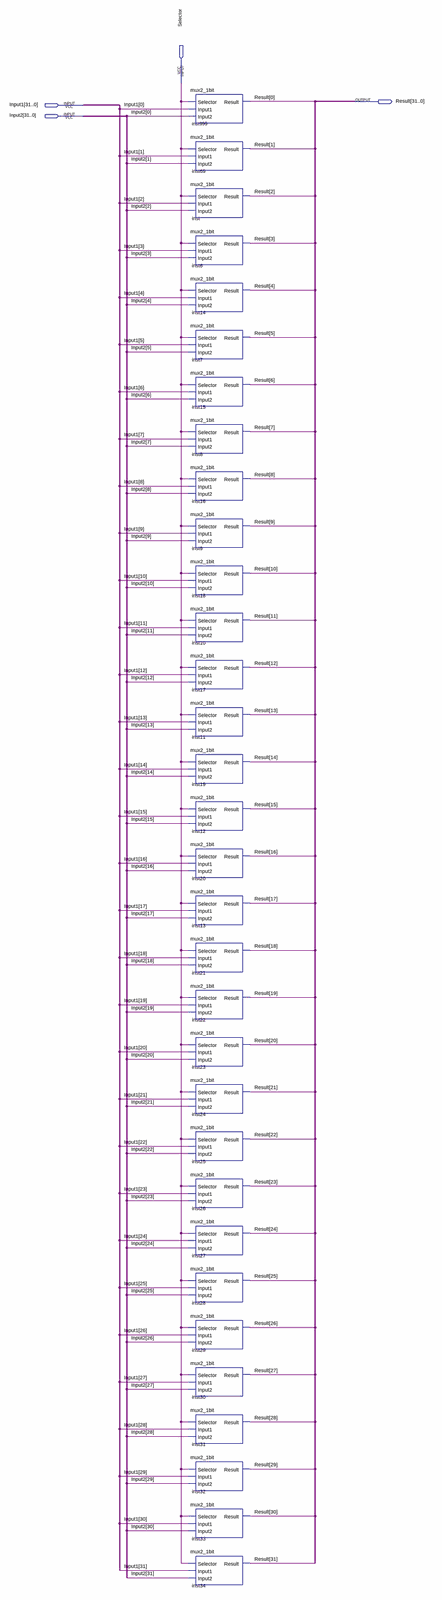
[diagram p0: schematic sheet, whole]
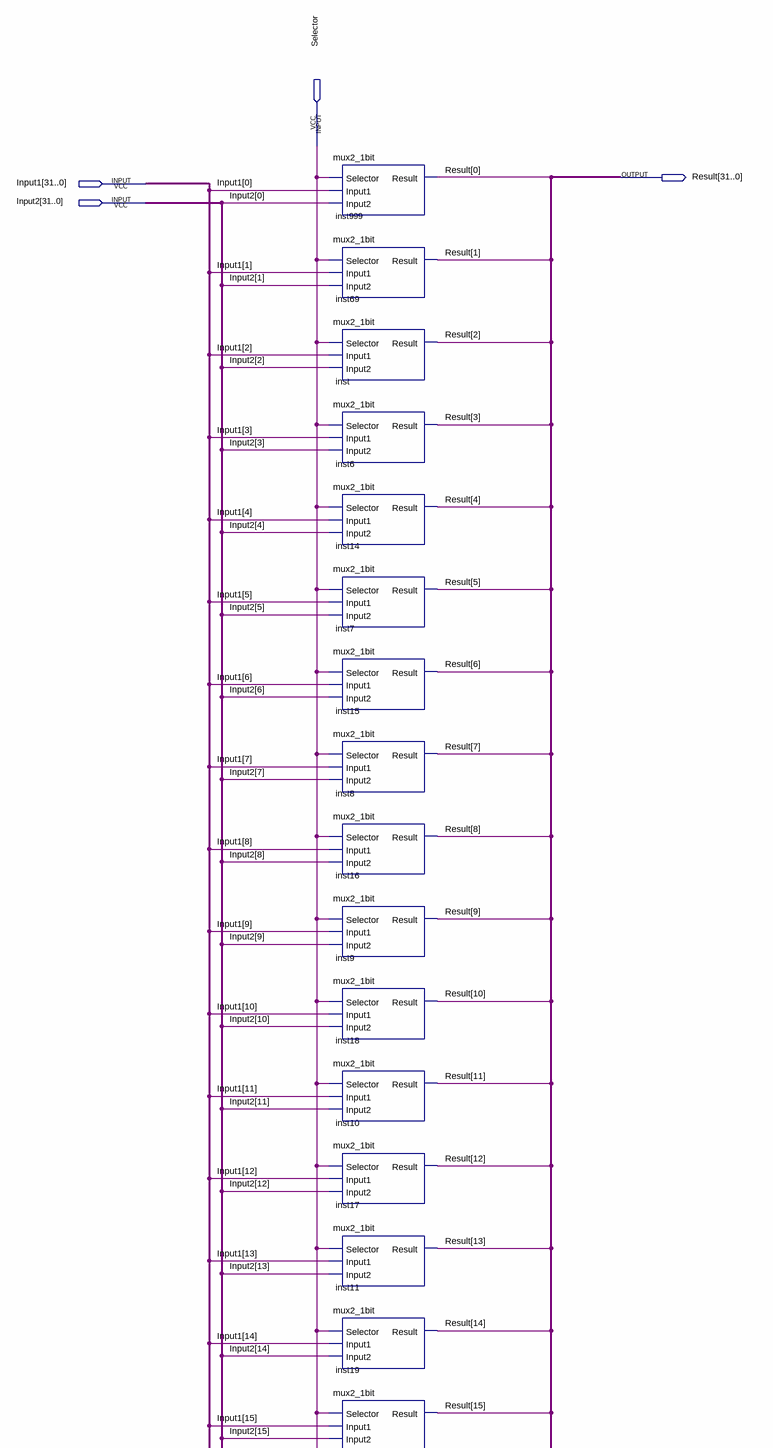
[diagram p1: schematic sheet, upper part]
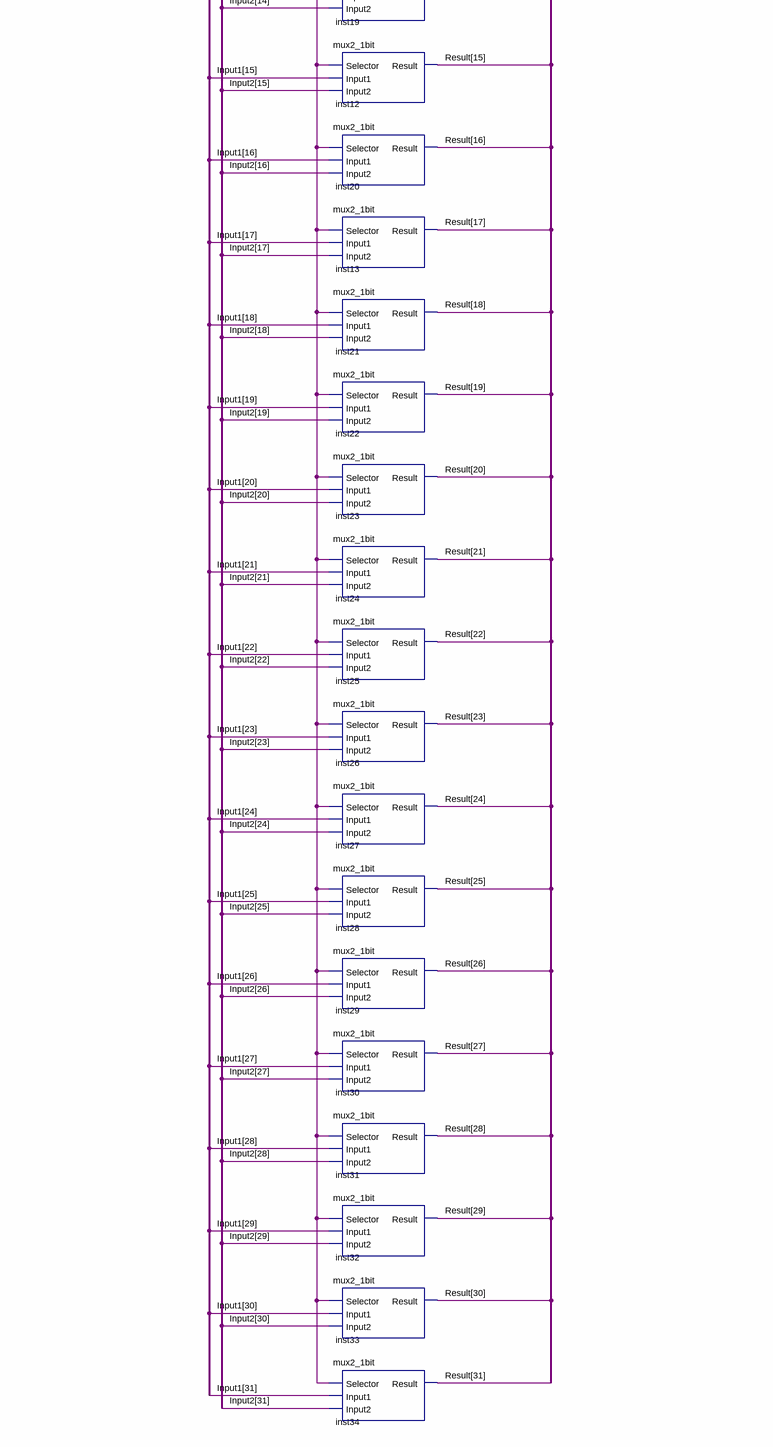
[diagram p2: schematic sheet, lower part]
// Quartus schematic mux2_32bit.bdf as structural Verilog: 32 symbols, 4 pins
module mux2_32bit (
  input  Selector,
  input  [31:0] Input1,
  input  [31:0] Input2,
  output [31:0] Result
);

  mux2_1bit inst999 (.Selector(Selector), .Input1(Input1[0]), .Input2(Input2[0]), .Result(Result[0]));
  mux2_1bit inst69 (.Selector(Selector), .Input1(Input1[1]), .Input2(Input2[1]), .Result(Result[1]));
  mux2_1bit inst (.Selector(Selector), .Input1(Input1[2]), .Input2(Input2[2]), .Result(Result[2]));
  mux2_1bit inst6 (.Selector(Selector), .Input1(Input1[3]), .Input2(Input2[3]), .Result(Result[3]));
  mux2_1bit inst14 (.Selector(Selector), .Input1(Input1[4]), .Input2(Input2[4]), .Result(Result[4]));
  mux2_1bit inst7 (.Selector(Selector), .Input1(Input1[5]), .Input2(Input2[5]), .Result(Result[5]));
  mux2_1bit inst15 (.Selector(Selector), .Input1(Input1[6]), .Input2(Input2[6]), .Result(Result[6]));
  mux2_1bit inst8 (.Selector(Selector), .Input1(Input1[7]), .Input2(Input2[7]), .Result(Result[7]));
  mux2_1bit inst16 (.Selector(Selector), .Input1(Input1[8]), .Input2(Input2[8]), .Result(Result[8]));
  mux2_1bit inst9 (.Selector(Selector), .Input1(Input1[9]), .Input2(Input2[9]), .Result(Result[9]));
  mux2_1bit inst18 (.Selector(Selector), .Input1(Input1[10]), .Input2(Input2[10]), .Result(Result[10]));
  mux2_1bit inst10 (.Selector(Selector), .Input1(Input1[11]), .Input2(Input2[11]), .Result(Result[11]));
  mux2_1bit inst17 (.Selector(Selector), .Input1(Input1[12]), .Input2(Input2[12]), .Result(Result[12]));
  mux2_1bit inst11 (.Selector(Selector), .Input1(Input1[13]), .Input2(Input2[13]), .Result(Result[13]));
  mux2_1bit inst19 (.Selector(Selector), .Input1(Input1[14]), .Input2(Input2[14]), .Result(Result[14]));
  mux2_1bit inst12 (.Selector(Selector), .Input1(Input1[15]), .Input2(Input2[15]), .Result(Result[15]));
  mux2_1bit inst20 (.Selector(Selector), .Input1(Input1[16]), .Input2(Input2[16]), .Result(Result[16]));
  mux2_1bit inst13 (.Selector(Selector), .Input1(Input1[17]), .Input2(Input2[17]), .Result(Result[17]));
  mux2_1bit inst21 (.Selector(Selector), .Input1(Input1[18]), .Input2(Input2[18]), .Result(Result[18]));
  mux2_1bit inst22 (.Selector(Selector), .Input1(Input1[19]), .Input2(Input2[19]), .Result(Result[19]));
  mux2_1bit inst23 (.Selector(Selector), .Input1(Input1[20]), .Input2(Input2[20]), .Result(Result[20]));
  mux2_1bit inst24 (.Selector(Selector), .Input1(Input1[21]), .Input2(Input2[21]), .Result(Result[21]));
  mux2_1bit inst25 (.Selector(Selector), .Input1(Input1[22]), .Input2(Input2[22]), .Result(Result[22]));
  mux2_1bit inst26 (.Selector(Selector), .Input1(Input1[23]), .Input2(Input2[23]), .Result(Result[23]));
  mux2_1bit inst27 (.Selector(Selector), .Input1(Input1[24]), .Input2(Input2[24]), .Result(Result[24]));
  mux2_1bit inst28 (.Selector(Selector), .Input1(Input1[25]), .Input2(Input2[25]), .Result(Result[25]));
  mux2_1bit inst29 (.Selector(Selector), .Input1(Input1[26]), .Input2(Input2[26]), .Result(Result[26]));
  mux2_1bit inst30 (.Selector(Selector), .Input1(Input1[27]), .Input2(Input2[27]), .Result(Result[27]));
  mux2_1bit inst31 (.Selector(Selector), .Input1(Input1[28]), .Input2(Input2[28]), .Result(Result[28]));
  mux2_1bit inst32 (.Selector(Selector), .Input1(Input1[29]), .Input2(Input2[29]), .Result(Result[29]));
  mux2_1bit inst33 (.Selector(Selector), .Input1(Input1[30]), .Input2(Input2[30]), .Result(Result[30]));
  mux2_1bit inst34 (.Selector(Selector), .Input1(Input1[31]), .Input2(Input2[31]), .Result(Result[31]));
endmodule
